# Altium schematic sheet RK3566_FLASH_SD.SchDoc
size A3; SheetNumber: 5; SheetTotal: 13
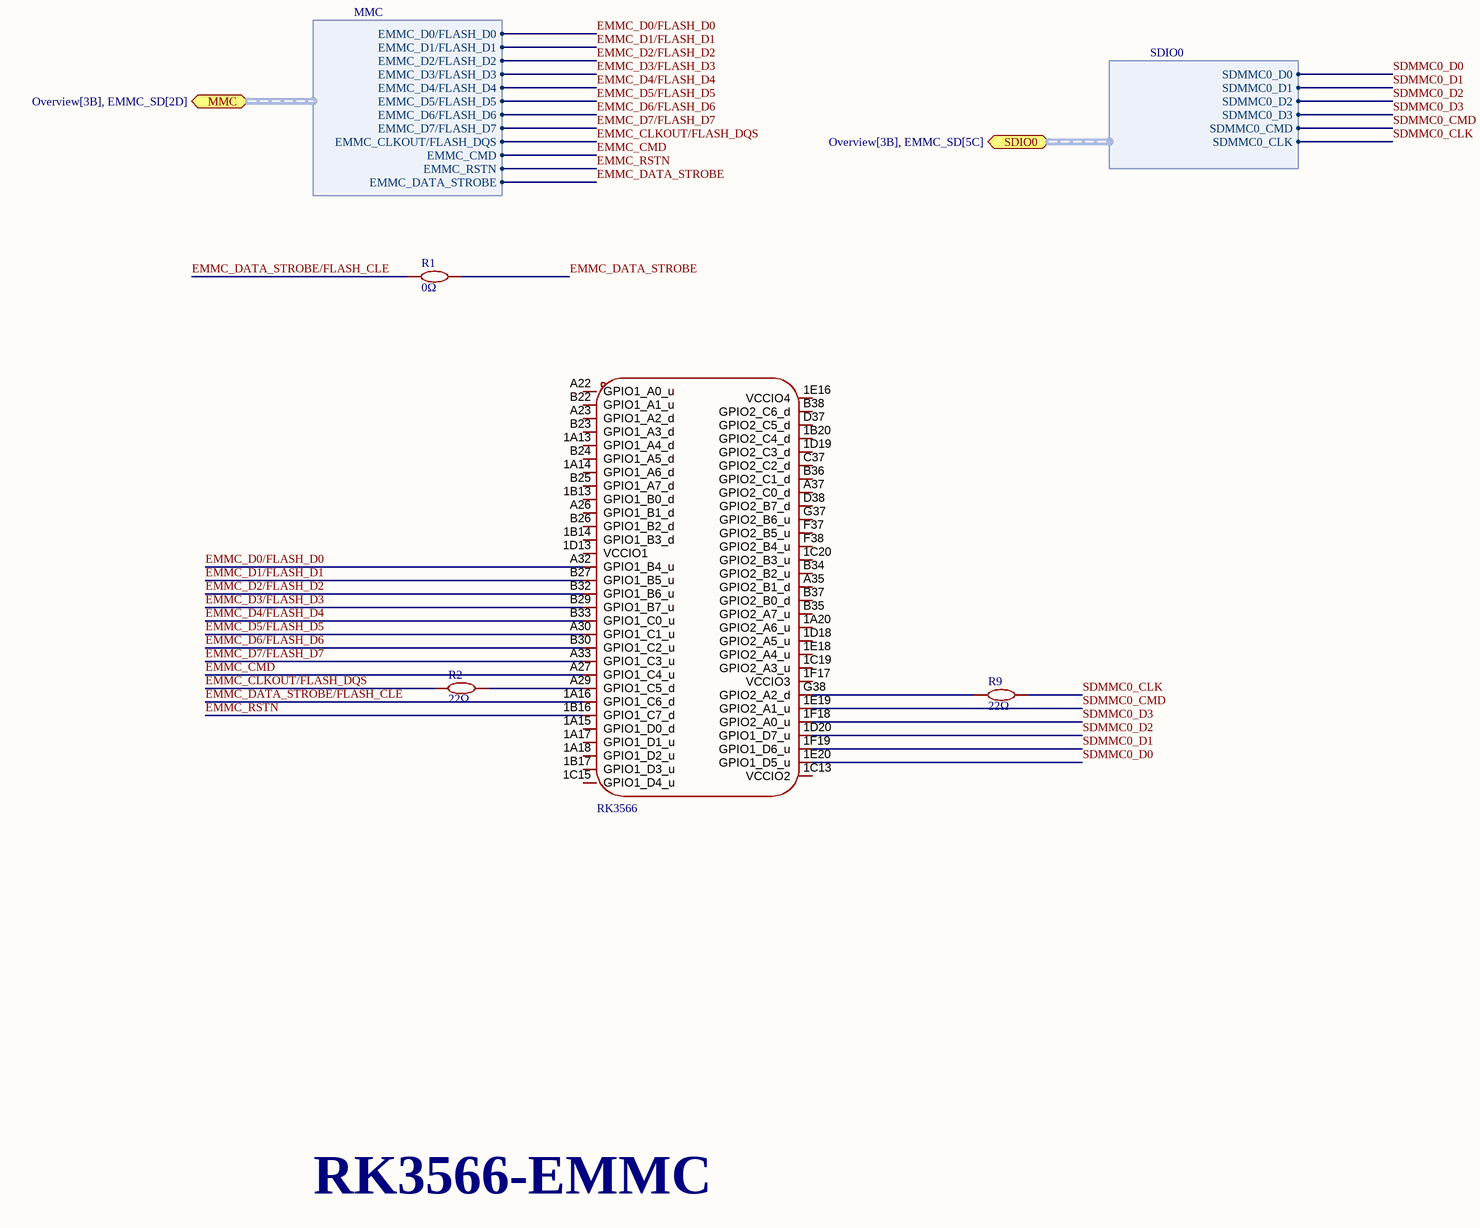
[diagram p0: RK3566_FLASH_SD.SchDoc]

## Parts
R1  0Ω  [R0402]
R2  22Ω  [R0402]
R9  22Ω  [R0402]
U1  RK3566  [BGA-565_L15.5-W14.4-P0.40_RK3566_1]  (part E of 8)

## Ports
MMC (bidir, harness MMC, see Overview[3B], EMMC_SD[2D]), SDIO0 (bidir, harness SDIO0, see Overview[3B], EMMC_SD[5C])

## Harnesses
MMC: EMMC_D0/FLASH_D0, EMMC_D1/FLASH_D1, EMMC_D2/FLASH_D2, EMMC_D3/FLASH_D3, EMMC_D4/FLASH_D4, EMMC_D5/FLASH_D5, EMMC_D6/FLASH_D6, EMMC_D7/FLASH_D7, EMMC_CLKOUT/FLASH_DQS, EMMC_CMD, EMMC_RSTN, EMMC_DATA_STROBE
SDIO0: SDMMC0_D0, SDMMC0_D1, SDMMC0_D2, SDMMC0_D3, SDMMC0_CMD, SDMMC0_CLK

## Nets
EMMC_CLKOUT/FLASH_DQS: R2.1 ; port MMC.EMMC_CLKOUT/FLASH_DQS
EMMC_CMD: U1.A27(GPIO1_C4_u) ; port MMC.EMMC_CMD
EMMC_D0/FLASH_D0: U1.A32(GPIO1_B4_u) ; port MMC.EMMC_D0/FLASH_D0
EMMC_D1/FLASH_D1: U1.B27(GPIO1_B5_u) ; port MMC.EMMC_D1/FLASH_D1
EMMC_D2/FLASH_D2: U1.B32(GPIO1_B6_u) ; port MMC.EMMC_D2/FLASH_D2
EMMC_D3/FLASH_D3: U1.B29(GPIO1_B7_u) ; port MMC.EMMC_D3/FLASH_D3
EMMC_D4/FLASH_D4: U1.B33(GPIO1_C0_u) ; port MMC.EMMC_D4/FLASH_D4
EMMC_D5/FLASH_D5: U1.A30(GPIO1_C1_u) ; port MMC.EMMC_D5/FLASH_D5
EMMC_D6/FLASH_D6: U1.B30(GPIO1_C2_u) ; port MMC.EMMC_D6/FLASH_D6
EMMC_D7/FLASH_D7: U1.A33(GPIO1_C3_u) ; port MMC.EMMC_D7/FLASH_D7
EMMC_DATA_STROBE: R1.2 ; port MMC.EMMC_DATA_STROBE
EMMC_DATA_STROBE/FLASH_CLE: R1.1 U1.1A16(GPIO1_C6_d)
EMMC_RSTN: U1.1B16(GPIO1_C7_d) ; port MMC.EMMC_RSTN
SDMMC0_CLK: R9.2 ; port SDIO0.SDMMC0_CLK
SDMMC0_CMD: U1.1E19(GPIO2_A1_u) ; port SDIO0.SDMMC0_CMD
SDMMC0_D0: U1.1E20(GPIO1_D5_u) ; port SDIO0.SDMMC0_D0
SDMMC0_D1: U1.1F19(GPIO1_D6_u) ; port SDIO0.SDMMC0_D1
SDMMC0_D2: U1.1D20(GPIO1_D7_u) ; port SDIO0.SDMMC0_D2
SDMMC0_D3: U1.1F18(GPIO2_A0_u) ; port SDIO0.SDMMC0_D3
NetR2_2: R2.2 U1.A29(GPIO1_C5_d)
NetR9_1: R9.1 U1.G38(GPIO2_A2_d)

Not connected (* = marked no-connect by the designer): U1 1A13(GPIO1_A4_d) 1A14(GPIO1_A6_d) 1A15(GPIO1_D0_d) 1A17(GPIO1_D1_u) 1A18(GPIO1_D2_u) 1A20(GPIO2_A6_u) 1B13(GPIO1_B0_d) 1B14(GPIO1_B3_d) 1B17(GPIO1_D3_u) 1B20(GPIO2_C4_d) 1C13(VCCIO2) 1C15(GPIO1_D4_u) 1C19(GPIO2_A3_u) 1C20(GPIO2_B3_u) 1D13(VCCIO1) 1D18(GPIO2_A5_u) 1D19(GPIO2_C3_d) 1E16(VCCIO4) 1E18(GPIO2_A4_u) 1F17(VCCIO3) A22(GPIO1_A0_u) A23(GPIO1_A2_d) A26(GPIO1_B1_d) A35(GPIO2_B1_d) A37(GPIO2_C0_d) B22(GPIO1_A1_u) B23(GPIO1_A3_d) B24(GPIO1_A5_d) B25(GPIO1_A7_d) B26(GPIO1_B2_d) B34(GPIO2_B2_u) B35(GPIO2_A7_u) B36(GPIO2_C1_d) B37(GPIO2_B0_d) B38(GPIO2_C6_d) C37(GPIO2_C2_d) D37(GPIO2_C5_d) D38(GPIO2_B7_d) F37(GPIO2_B5_u) F38(GPIO2_B4_u) G37(GPIO2_B6_u)

## Notes on the sheet
- RK3566-EMMC

## Library data of the parts
R1 = 0Ω: 0Ω 62.5mW 50V Thick Film Resistor ±1% 0402 Chip Resistor - Surface Mount ROHS
R2 R9 = 22Ω: 62.5mW 33Ω 50V ±100ppm/℃ Thick Film Resistor ±1% 0402 Chip Resistor - Surface Mount ROHS
U1 = RK3566: BGA-565(15.5x14.4); Symbol: RK3566